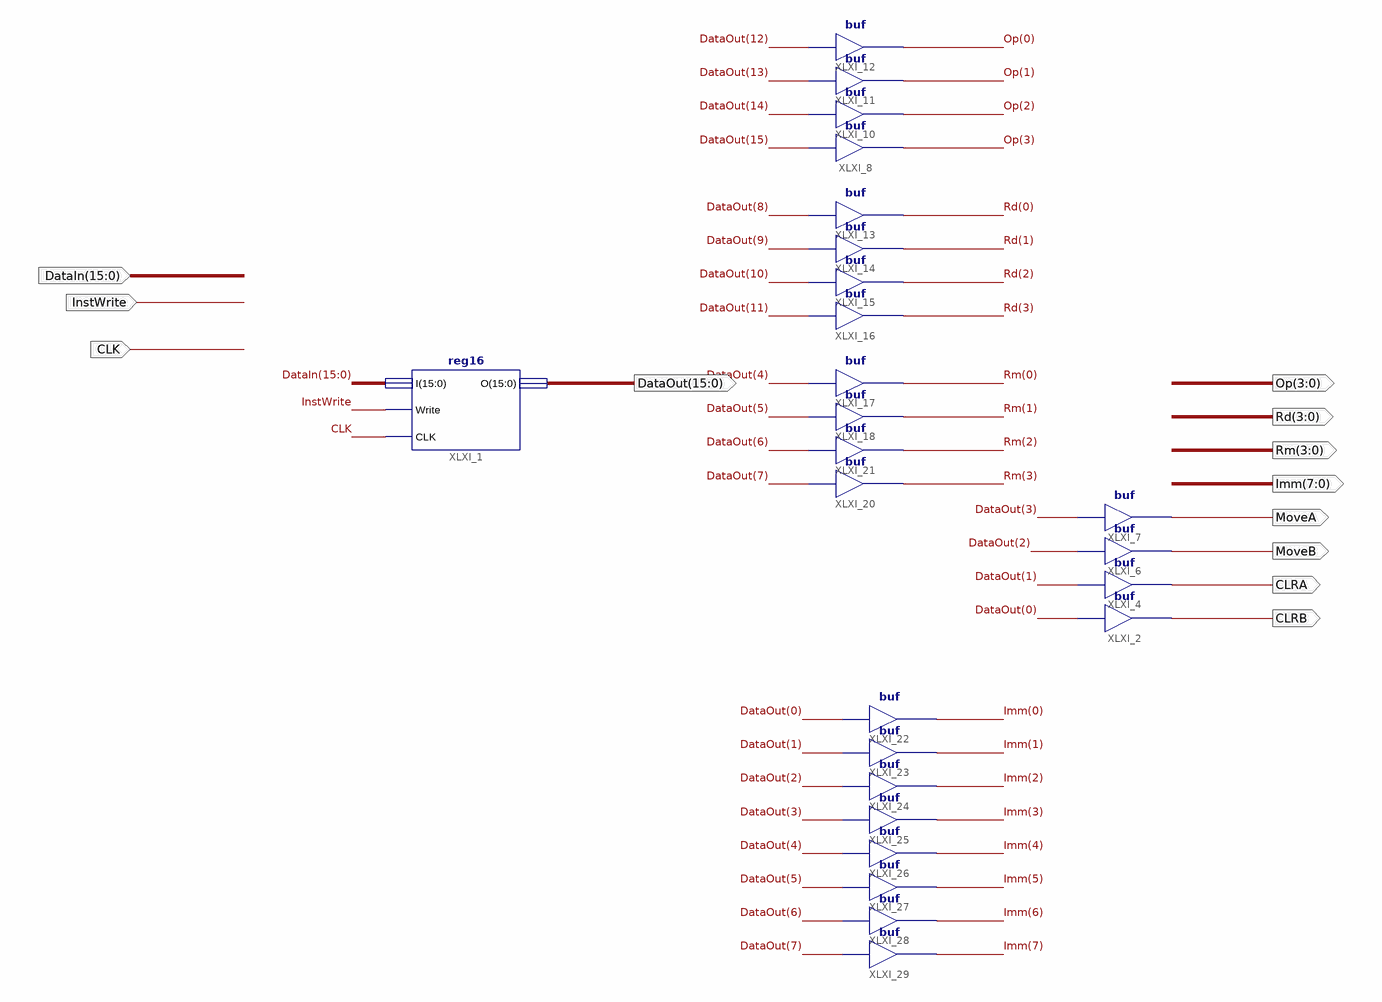
[diagram p0: schematic sheet 1]
// Xilinx ISE schematic InstructionRegister.sch (spartan3e) as structural Verilog: 25 symbols, 12 ports
module InstructionRegister (
  input  [15:0] DataIn,
  input  InstWrite,
  input  CLK,
  output [15:0] DataOut,
  output MoveA,
  output MoveB,
  output CLRA,
  output CLRB,
  output [7:0] Imm,
  output [3:0] Rm,
  output [3:0] Rd,
  output [3:0] Op
);

  reg16 XLXI_1 (.I(DataIn), .Write(InstWrite), .CLK(CLK), .O(DataOut));
  buf XLXI_2 (CLRB, DataOut[0]);
  buf XLXI_4 (CLRA, DataOut[1]);
  buf XLXI_6 (MoveB, DataOut[2]);
  buf XLXI_7 (MoveA, DataOut[3]);
  buf XLXI_8 (Op[3], DataOut[15]);
  buf XLXI_10 (Op[2], DataOut[14]);
  buf XLXI_11 (Op[1], DataOut[13]);
  buf XLXI_12 (Op[0], DataOut[12]);
  buf XLXI_13 (Rd[0], DataOut[8]);
  buf XLXI_14 (Rd[1], DataOut[9]);
  buf XLXI_15 (Rd[2], DataOut[10]);
  buf XLXI_16 (Rd[3], DataOut[11]);
  buf XLXI_17 (Rm[0], DataOut[4]);
  buf XLXI_18 (Rm[1], DataOut[5]);
  buf XLXI_20 (Rm[3], DataOut[7]);
  buf XLXI_21 (Rm[2], DataOut[6]);
  buf XLXI_22 (Imm[0], DataOut[0]);
  buf XLXI_23 (Imm[1], DataOut[1]);
  buf XLXI_24 (Imm[2], DataOut[2]);
  buf XLXI_25 (Imm[3], DataOut[3]);
  buf XLXI_26 (Imm[4], DataOut[4]);
  buf XLXI_27 (Imm[5], DataOut[5]);
  buf XLXI_28 (Imm[6], DataOut[6]);
  buf XLXI_29 (Imm[7], DataOut[7]);
endmodule
